# Altium schematic sheet Mother Board Connectors.SchDoc
size B
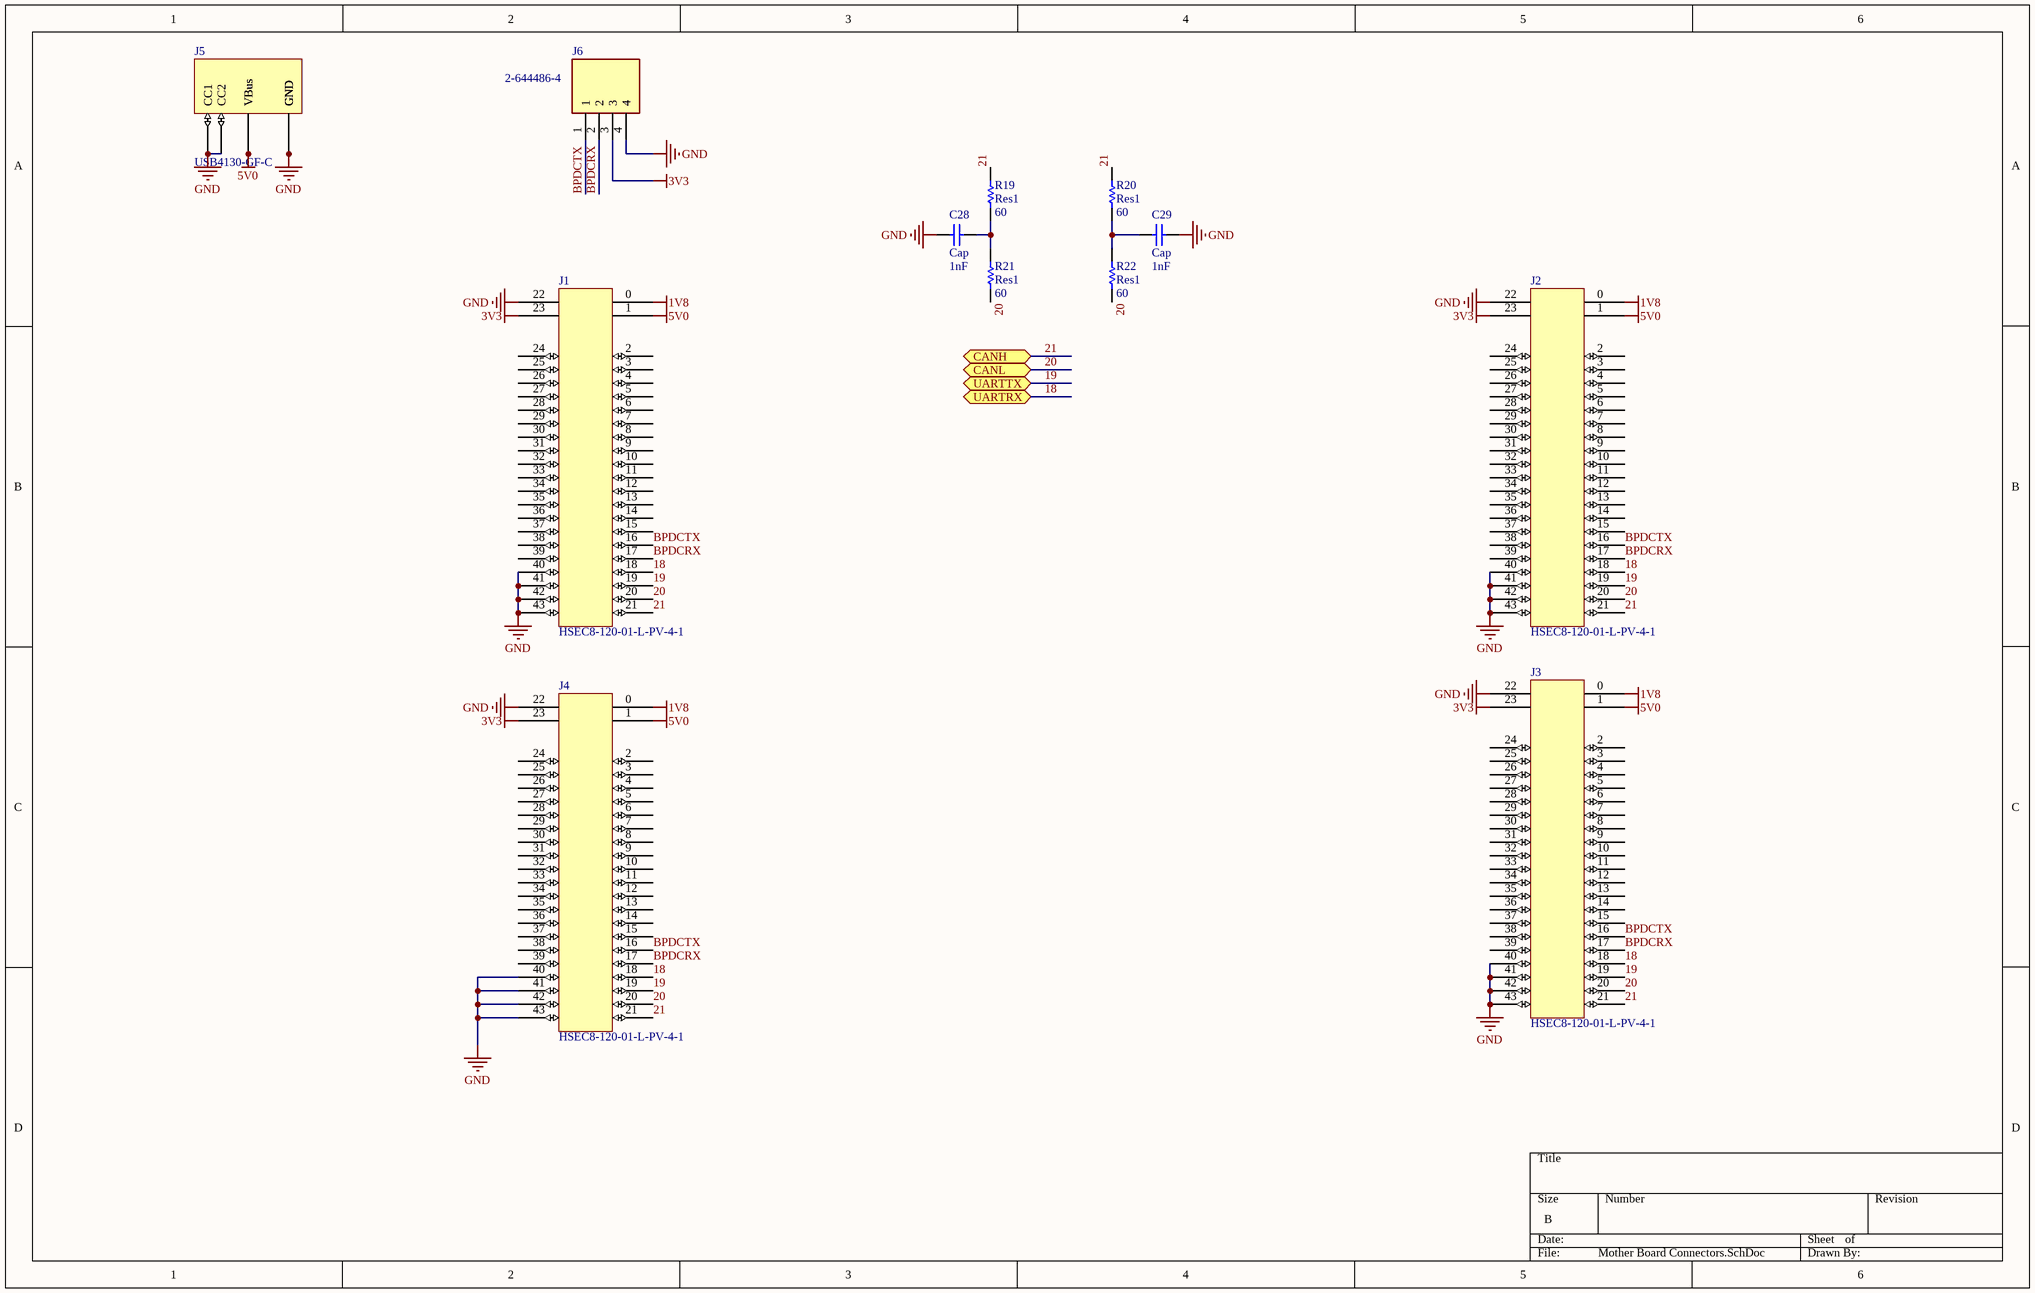
[diagram p0: Mother Board Connectors.SchDoc]

## Parts
C28  Cap  value 1nF  [1608[0603]]
C29  Cap  value 1nF  [1608[0603]]
J1  HSEC8-120-01-L-PV-4-1  [HSEC8-120-01-L-PV-4-1]
J2  HSEC8-120-01-L-PV-4-1  [HSEC8-120-01-L-PV-4-1]
J3  HSEC8-120-01-L-PV-4-1  [HSEC8-120-01-L-PV-4-1]
J4  HSEC8-120-01-L-PV-4-1  [HSEC8-120-01-L-PV-4-1]
J5  USB4130-GF-C  [USB4130-GF-C]
J6  2-644486-4  [26444864]
R19  Res1  value 60  [0402-A]
R20  Res1  value 60  [0402-A]
R21  Res1  value 60  [0402-A]
R22  Res1  value 60  [0402-A]

## Ports
CANH (bidir), CANL (bidir), UARTRX (bidir), UARTTX (bidir)

## Nets
1V8: J1.0 J2.0 J3.0 J4.0
3V3: J1.23 J2.23 J3.23 J4.23 J6.3
5V0: J1.1 J2.1 J3.1 J4.1 J5.2(VBus) J5.5(VBus)
GND: C28.2 C29.1 J1.22 J1.40 J1.41 J1.42 J1.43 J2.22 J2.40 J2.41 J2.42 J2.43 J3.22 J3.40 J3.41 J3.42 J3.43 J4.22 J4.40 J4.41 J4.42 J4.43 J5.1(GND) J5.3(CC1) J5.4(CC2) J5.6(GND) J5.7(GND) J5.8(GND) J6.4
18: J1.18 J2.18 J3.18 J4.18 ; port UARTRX
19: J1.19 J2.19 J3.19 J4.19 ; port UARTTX
20: J1.20 J2.20 J3.20 J4.20 R21.1 R22.1 ; port CANL
21: J1.21 J2.21 J3.21 J4.21 R19.2 R20.2 ; port CANH
BPDCRX: J1.17 J2.17 J3.17 J4.17 J6.2
BPDCTX: J1.16 J2.16 J3.16 J4.16 J6.1
NetC28_1: C28.1 R19.1 R21.2
NetC29_2: C29.2 R20.1 R22.2

Not connected (* = marked no-connect by the designer): J1 2(0) 3(0) 4(0) 5(0) 6(0) 7(0) 8(0) 9(0) 10(0) 11(0) 12(0) 13(0) 14(0) 15(0) 24 25 26 27 28 29 30 31 32 33 34 35 36 37 38 39; J2 2(0) 3(0) 4(0) 5(0) 6(0) 7(0) 8(0) 9(0) 10(0) 11(0) 12(0) 13(0) 14(0) 15(0) 24 25 26 27 28 29 30 31 32 33 34 35 36 37 38 39; J3 2(0) 3(0) 4(0) 5(0) 6(0) 7(0) 8(0) 9(0) 10(0) 11(0) 12(0) 13(0) 14(0) 15(0) 24 25 26 27 28 29 30 31 32 33 34 35 36 37 38 39; J4 2(0) 3(0) 4(0) 5(0) 6(0) 7(0) 8(0) 9(0) 10(0) 11(0) 12(0) 13(0) 14(0) 15(0) 24 25 26 27 28 29 30 31 32 33 34 35 36 37 38 39

## Library data of the parts
C28 C29 = Cap: Capacitor; Published: 8-Jun-2000; LatestRevisionDate: 17-Jul-2002; LatestRevisionNote: Re-released for DXP Platform.; PackageReference: RAD-0.3; Publisher: Altium Limited; PackageDescription: Radial Cap, Thru-Hole; 2 Leads; 0.3 in Pin Spacing
J6 = 2-644486-4: Connector; Manufacturer_Name: TE Connectivity; Datasheet Link: http://www.te.com/commerce/DocumentDelivery/DDEController?Action=showdoc&DocId=Customer+Drawing%7F644486%7FL%7Fpdf%7FEnglish%7FENG_CD_644486_L_baseFilename.pdf%7F2-644486-4.pdf; Height: 10.668mm; Manufacturer_Part_Number: 2-644486-4; Mouser Part Number: 571-2-644486-4; Mouser Price/Stock: https://www.mouser.co.uk/ProductDetail/TE-Connectivity-AMP/2-644486-4?qs=8XyASyDp%2FcDn2y5ith8QSA%3D%3D; Arrow Part Number: 2-644486-4; Arrow Price/Stock: https://www.arrow.com/en/products/2-644486-4/te-connectivity
R19-R22 = Res1: Resistor; Published: 8-Jun-2000; LatestRevisionDate: 17-Jul-2002; LatestRevisionNote: Re-released for DXP Platform.; PackageReference: AXIAL-0.3; Publisher: Altium Limited; PackageDescription: Axial Device, Thru-Hole; 2 Leads; 0.3 in Pin Spacing
J1-J4 = HSEC8-120-01-L-PV-4-1: Supplier 1: Mouser